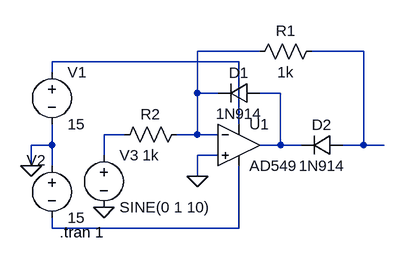
[diagram p0: schematic InvertingRectifier.asc]
InvertingRectifier.asc, the LTspice schematic file:
Version 4
SHEET 1 880 680
WIRE 400 64 304 64
WIRE 560 64 480 64
WIRE 368 80 80 80
WIRE 80 96 80 80
WIRE 304 128 304 64
WIRE 336 128 304 128
WIRE 432 128 400 128
WIRE 368 176 368 80
WIRE 192 192 160 192
WIRE 304 192 304 128
WIRE 304 192 272 192
WIRE 336 192 304 192
WIRE 80 208 80 176
WIRE 80 208 48 208
WIRE 432 208 432 128
WIRE 432 208 400 208
WIRE 464 208 432 208
WIRE 560 208 560 64
WIRE 560 208 528 208
WIRE 592 208 560 208
WIRE 160 224 160 192
WIRE 336 224 304 224
WIRE 48 240 48 208
WIRE 80 240 80 208
WIRE 304 256 304 224
WIRE 80 336 80 320
WIRE 368 336 368 240
WIRE 368 336 80 336
FLAG 304 256 0
FLAG 160 304 0
FLAG 48 240 0
SYMBOL voltage 80 80 R0
WINDOW 123 0 0 Left 0
WINDOW 39 0 0 Left 0
SYMATTR InstName V1
SYMATTR Value 15
SYMBOL voltage 80 224 R0
WINDOW 0 -39 7 Left 2
WINDOW 123 0 0 Left 0
WINDOW 39 0 0 Left 0
SYMATTR InstName V2
SYMATTR Value 15
SYMBOL voltage 160 208 R0
WINDOW 123 0 0 Left 0
WINDOW 39 0 0 Left 0
SYMATTR InstName V3
SYMATTR Value SINE(0 1 10)
SYMBOL Opamps\\AD549 368 144 R0
SYMATTR InstName U1
SYMBOL diode 400 112 R90
WINDOW 0 0 32 VBottom 2
WINDOW 3 32 32 VTop 2
SYMATTR InstName D1
SYMATTR Value 1N914
SYMBOL diode 528 192 R90
WINDOW 0 0 32 VBottom 2
WINDOW 3 32 32 VTop 2
SYMATTR InstName D2
SYMATTR Value 1N914
SYMBOL res 496 48 R90
WINDOW 0 0 56 VBottom 2
WINDOW 3 32 56 VTop 2
SYMATTR InstName R1
SYMATTR Value 1k
SYMBOL res 288 176 R90
WINDOW 0 0 56 VBottom 2
WINDOW 3 32 56 VTop 2
SYMATTR InstName R2
SYMATTR Value 1k
TEXT 92 342 Left 2 !.tran 1

The netlist it stands for:
* InvertingRectifier.asc
V1 N003 0 15
V2 0 N006 15
V3 N005 0 SINE(0 1 10)
XU1 0 N001 N003 N006 N004 AD549  ; pins In+ In- V+ V- OUT
D1 N004 N001 1N914
D2 N002 N004 1N914
R1 N002 N001 1k
R2 N001 N005 1k
.model D D
.lib standard.dio
.tran 1
.backanno
.end